# EAGLE design capa_brd (EAGLE 7.7.0)
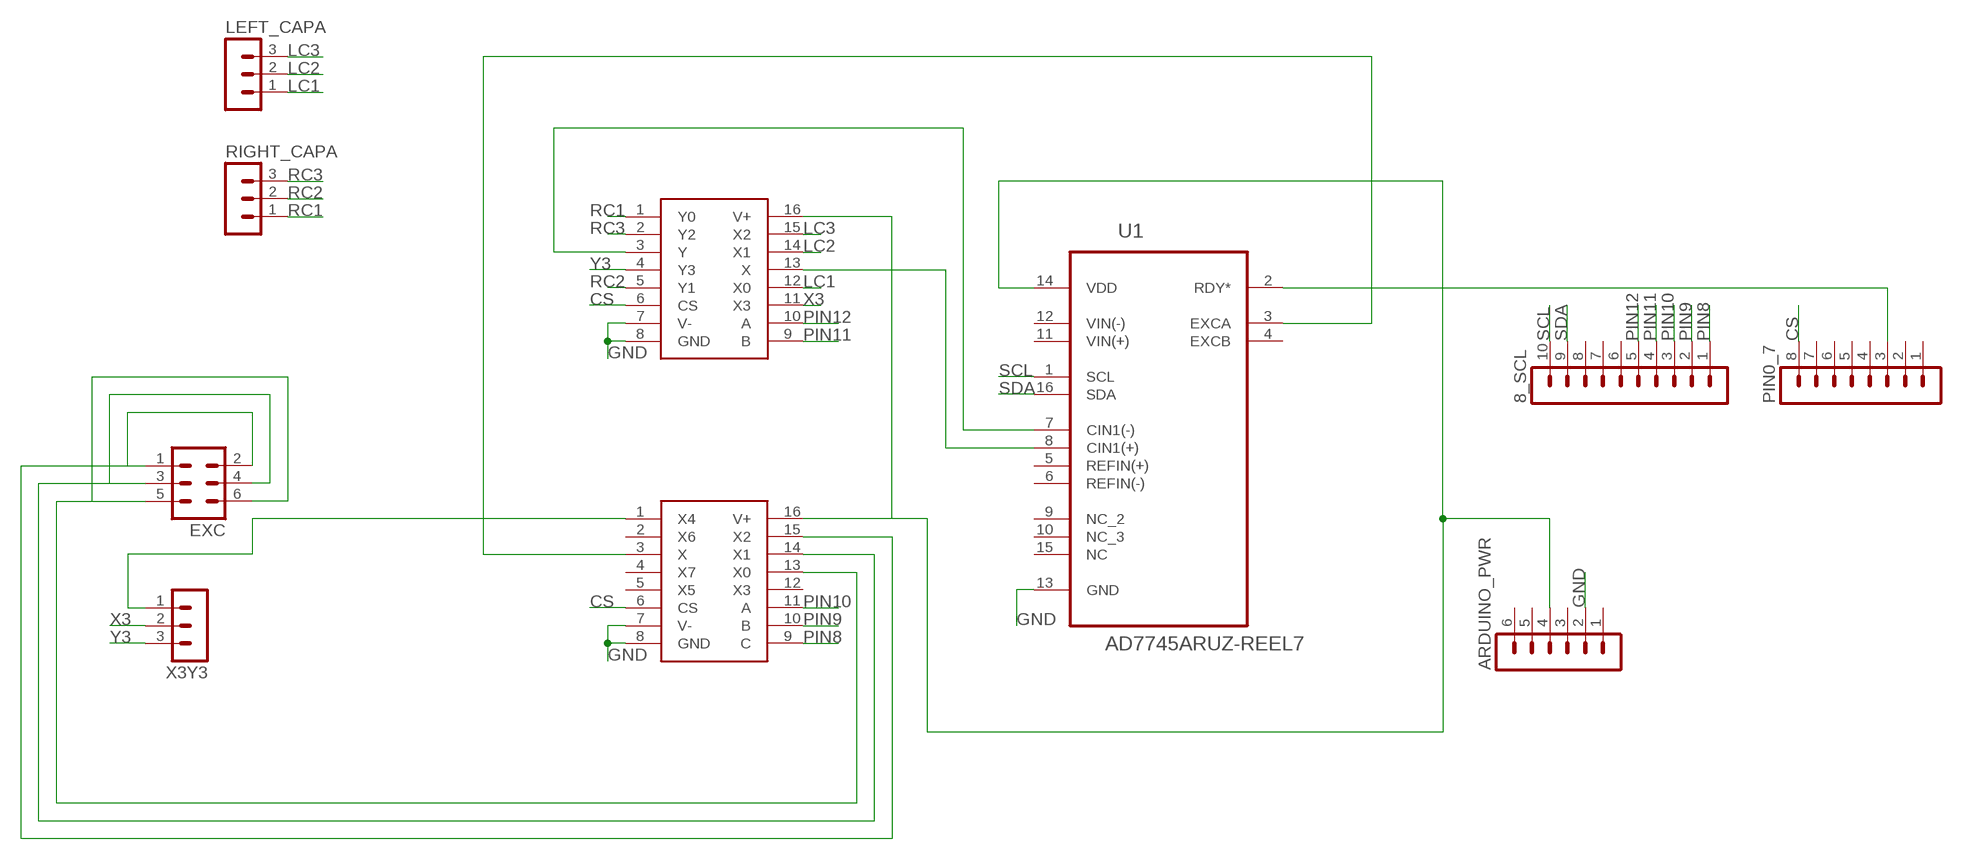
[diagram p0: schematic, sheet 1]

## Parts
8_SCL  MA10-1  [MA10-1]
ARDUINO_PWR  MA06-1  [MA06-1]
EXC  MA03-2  [MA03-2]
LEFT_CAPA  MA03-1  [MA03-1]
PIN0_7  MA08-1  [MA08-1]
RIGHT_CAPA  MA03-1  [MA03-1]
U1  AD7745ARUZ-REEL7  [SOP65P640X120-16N]
U$1  DG4051E  [DG4051E]
U$2  DG4052E  [DG4052E]
X3Y3  MA03-1  [MA03-1]

## Nets
CS: PIN0_7.8 U$1.6(CS) U$2.6(CS)
GND: ARDUINO_PWR.2 U1.13(GND) U$1.7(V-) U$1.8(GND) U$2.7(V-) U$2.8(GND)
LC1: LEFT_CAPA.1 U$2.12(X0)
LC2: LEFT_CAPA.2 U$2.14(X1)
LC3: LEFT_CAPA.3 U$2.15(X2)
N$1: U1.8(CIN1(+)) U$2.13(X)
N$2: U1.7(CIN1(-)) U$2.3(Y)
N$3: U1.3(EXCA) U$1.3(X)
N$4: EXC.5 EXC.6 U$1.13(X0)
N$5: EXC.3 EXC.4 U$1.14(X1)
N$6: EXC.1 EXC.2 U$1.15(X2)
N$7: PIN0_7.3 U1.2(RDY*)
N$8: ARDUINO_PWR.4 U1.14(VDD) U$1.16(V+) U$2.16(V+)
N$9: U$1.1(X4) X3Y3.1
PIN8: 8_SCL.1 U$1.9(C)
PIN9: 8_SCL.2 U$1.10(B)
PIN10: 8_SCL.3 U$1.11(A)
PIN11: 8_SCL.4 U$2.9(B)
PIN12: 8_SCL.5 U$2.10(A)
RC1: RIGHT_CAPA.1 U$2.1(Y0)
RC2: RIGHT_CAPA.2 U$2.5(Y1)
RC3: RIGHT_CAPA.3 U$2.2(Y2)
SCL: 8_SCL.10 U1.1(SCL)
SDA: 8_SCL.9 U1.16(SDA)
X3: U$2.11(X3) X3Y3.2
Y3: U$2.4(Y3) X3Y3.3
Unconnected: 8_SCL.6 8_SCL.7 8_SCL.8 ARDUINO_PWR.1 ARDUINO_PWR.3 ARDUINO_PWR.5 ARDUINO_PWR.6 PIN0_7.1 PIN0_7.2 PIN0_7.4 PIN0_7.5 PIN0_7.6 PIN0_7.7 U1.4(EXCB) U1.5(REFIN(+)) U1.6(REFIN(-)) U1.9(NC_2) U1.10(NC_3) U1.11(VIN(+)) U1.12(VIN(-)) U1.15(NC) U$1.2(X6) U$1.4(X7) U$1.5(X5) U$1.12(X3)

## Library data of the parts
8_SCL = con-lstb:MA10-1: PIN HEADER; OC_FARNELL: unknown; OC_NEWARK: unknown
ARDUINO_PWR = con-lstb:MA06-1: PIN HEADER; OC_FARNELL: unknown; OC_NEWARK: unknown
EXC = con-lstb:MA03-2: PIN HEADER; OC_FARNELL: unknown; OC_NEWARK: unknown
LEFT_CAPA RIGHT_CAPA X3Y3 = con-lstb:MA03-1: PIN HEADER; OC_FARNELL: unknown; OC_NEWARK: unknown
PIN0_7 = con-lstb:MA08-1: PIN HEADER; OC_FARNELL: unknown; OC_NEWARK: unknown
U1 = AD7745ARUZ-REEL7:AD7745ARUZ-REEL7: Capacitance-to-Digital Converter; DESCRIPTION: Capacitance-to-Digital Converter 24 b - Serial 16-TSSOP; DIGI-KEY_PART_NUMBER: AD7745ARUZ-REEL7TR-ND; MF: Analog Devices; MP: AD7745ARUZ-REEL7; PACKAGE: TSSOP-16 Analog Devices; PURCHASE-URL: https://pricing.snapeda.com/search/part/AD7745ARUZ-REEL7/?ref=eda
U$1 = DG4051E:DG4051E
U$2 = DG4051E:DG4052E

## Module GND
Ports: 

### Library data of the parts

## Board
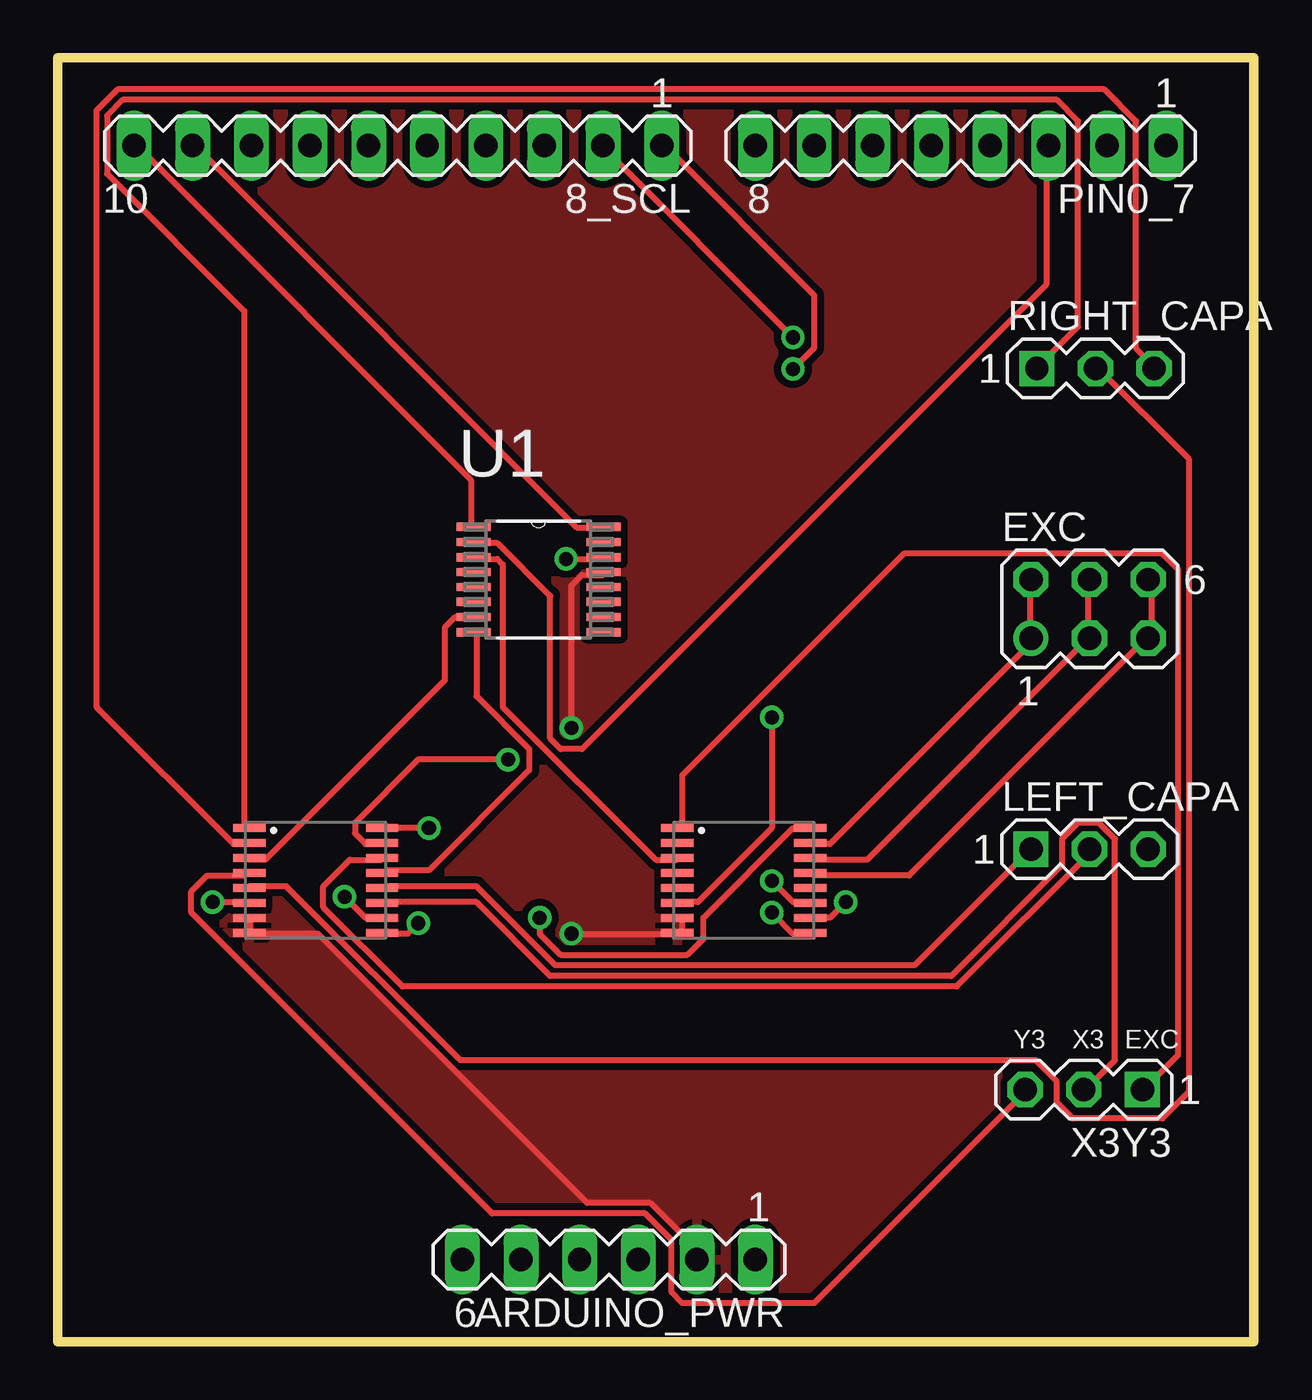
[diagram p1: board, top side]
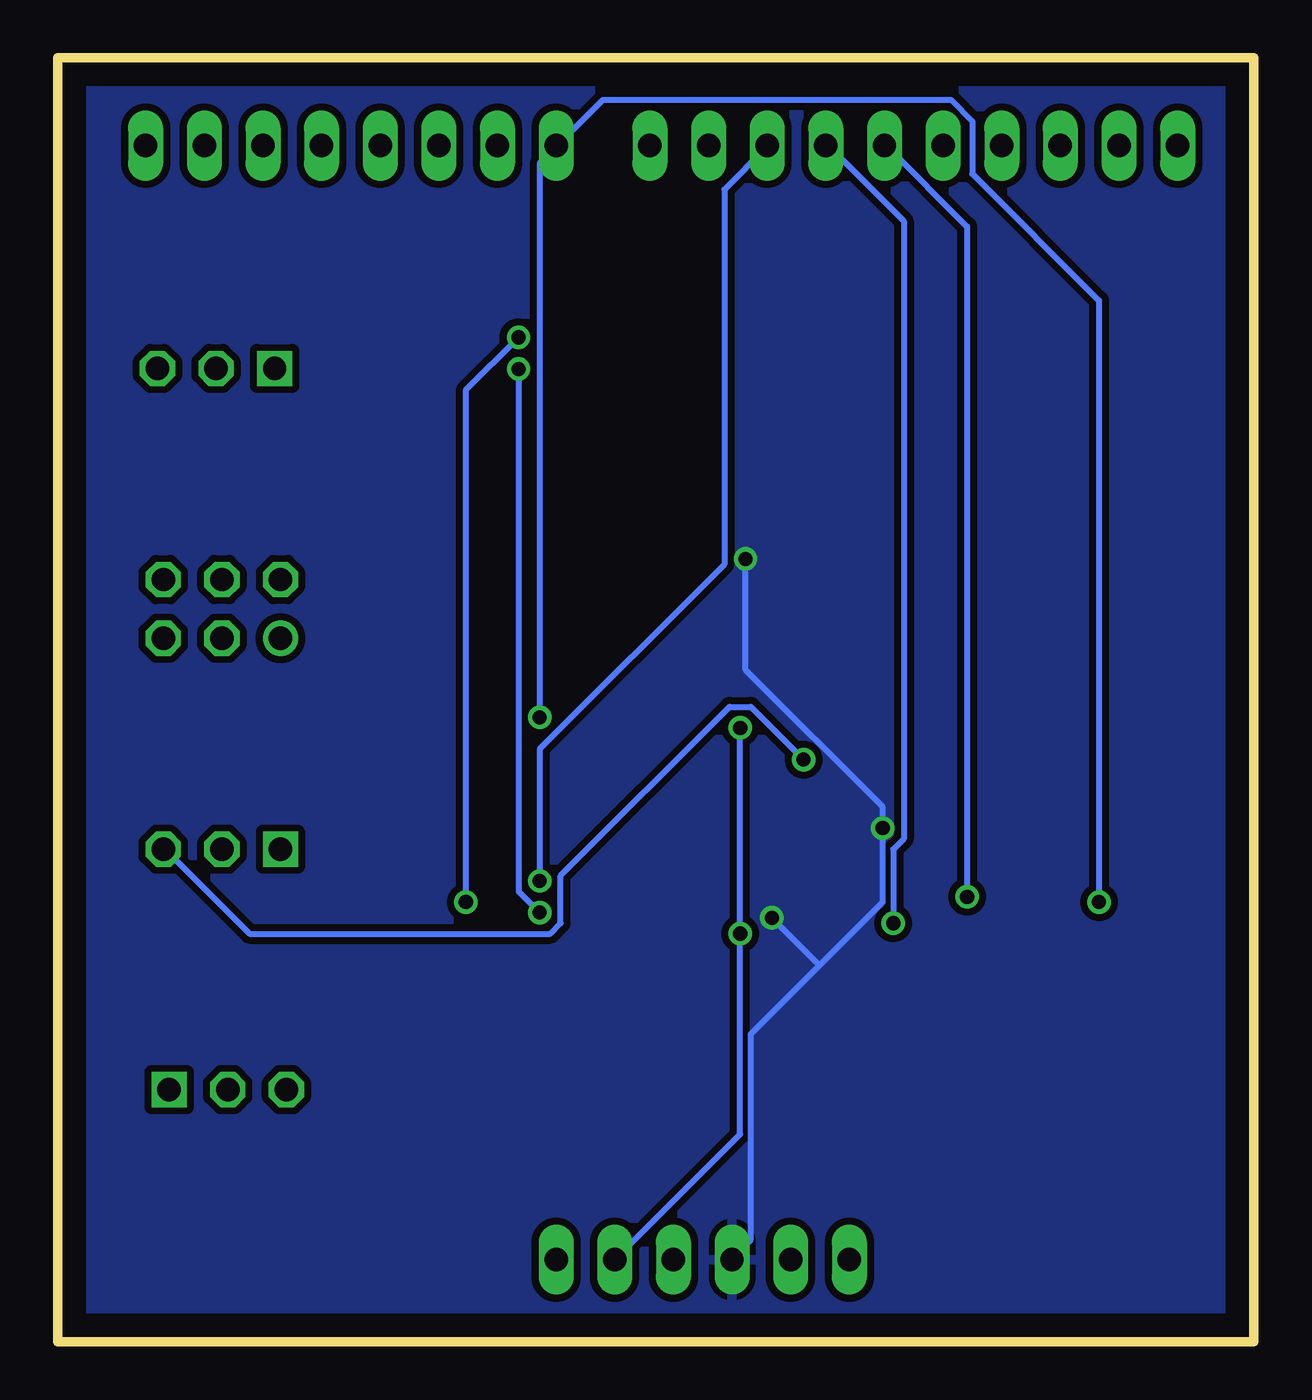
[diagram p2: board, bottom side, seen from below]

Size 51.82 x 55.63 mm. Coordinates in mm from the lower left corner, seen from the top.
Outline: 51.82,55.63 51.82,0 0,0 0,55.63 51.82,55.63
Copper layers (1*16): Top 0.035mm / dielectric 1.5mm / Bottom 0.035mm
Design rules "default": minimum track width 10mil, minimum drill 24mil, track to track 8mil, track to pad 8mil, pad to pad 8mil, via to via 8mil, smd to smd 8mil, copper to edge 40mil, drill to drill 8mil, minimum pad ring 10mil, minimum via ring 8mil, stop-mask expansion 4mil, vias tented up to drill 0mil, thermal gap 10mil

### Footprints (pad centres in the part's own frame; a part is rotated, then mirrored left to right if it is on the bottom)
MA10-1 = drill 1.016 long: 1 -11.43,0; 2 -8.89,0; 3 -6.35,0; 4 -3.81,0; 5 -1.27,0; 6 1.27,0; 7 3.81,0; 8 6.35,0; 9 8.89,0; 10 11.43,0
MA06-1 = drill 1.016 long: 1 -6.35,0; 2 -3.81,0; 3 -1.27,0; 4 1.27,0; 5 3.81,0; 6 6.35,0
MA03-2 = drill 1.016: 1 -2.54,-1.27 | drill 1.016 octagon: 2 -2.54,1.27; 3 0,-1.27; 4 0,1.27; 5 2.54,-1.27; 6 2.54,1.27
MA03-1 = drill 1.016 square: 1 -2.54,0 | drill 1.016 octagon: 2 0,0; 3 2.54,0
MA08-1 = drill 1.016 long: 1 -8.89,0; 2 -6.35,0; 3 -3.81,0; 4 -1.27,0; 5 1.27,0; 6 3.81,0; 7 6.35,0; 8 8.89,0
SOP65P640X120-16N = smd 1.473 x 0.356: 1 -2.819,2.286; 2 -2.819,1.626; 3 -2.819,0.965; 4 -2.819,0.33; 5 -2.819,-0.33; 6 -2.819,-0.965; 7 -2.819,-1.626; 8 -2.819,-2.286; 9 2.819,-2.286; 10 2.819,-1.626; 11 2.819,-0.965; 12 2.819,-0.33; 13 2.819,0.33; 14 2.819,0.965; 15 2.819,1.626; 16 2.819,2.286
DG4051E = smd 0.35 x 1.4: 1 -2.45,-2.875; 2 -1.8,-2.875; 3 -1.15,-2.875; 4 -0.5,-2.875; 5 0.15,-2.875; 6 0.8,-2.875; 7 1.45,-2.875; 8 2.1,-2.875; 9 2.1,2.875; 10 1.45,2.875; 11 0.8,2.875; 12 0.15,2.875; 13 -0.5,2.875; 14 -1.15,2.875; 15 -1.8,2.875; 16 -2.45,2.875
DG4052E = smd 0.35 x 1.4: 1 -2.45,-2.875; 2 -1.8,-2.875; 3 -1.15,-2.875; 4 -0.5,-2.875; 5 0.15,-2.875; 6 0.8,-2.875; 7 1.45,-2.875; 8 2.1,-2.875; 9 2.1,2.875; 10 1.45,2.875; 11 0.8,2.875; 12 0.15,2.875; 13 -0.5,2.875; 14 -1.15,2.875; 15 -1.8,2.875; 16 -2.45,2.875

### Placement (x,y rotation side)
8_SCL  14.73,51.82 180 top
ARDUINO_PWR  23.88,3.56 180 top
EXC  44.7,31.75 0 top
LEFT_CAPA  44.7,21.34 0 top
PIN0_7  39.12,51.82 180 top
RIGHT_CAPA  44.96,42.16 0 top
U1  20.83,33.02 0 top
U$1  29.72,19.81 270 top
U$2  11.18,19.81 270 top
X3Y3  44.45,10.92 180 top

### Tracks (layer width: path | path; a pad name or v marks a point on that pad's centre or on a via)
CS  (via drill 0.61)
  Top 0.254: v6.71,19.05 8.08,19.05 U$2.6 | v30.94,27.05 30.94,22.25 27.74,19.05 27.05,19.05 U$1.6
  Bottom 0.254: v6.71,19.05 6.71,45.11 12.19,50.6 12.19,52.88 13.11,53.8 28.19,53.8 30.02,51.97 PIN0_7.8 30.25,51.74 30.94,51.05 v30.94,27.05
GND  (via drill 0.61)
  Top 0.254: U$1.7 27.05,18.36 27.05,17.68 U$1.8 26.82,17.68 v22.25,17.68 | 8.31,17.68 U$2.7 | v22.25,26.59 22.25,32.77 22.71,33.22 23.62,33.22 U1.13 | 8.31,17.68 11.28,17.68 22.94,6.02 25.68,6.02 27.51,4.19 27.51,3.73 ARDUINO_PWR.2 | 8.31,17.68 U$2.8
  Bottom 0.254: v22.25,26.59 v22.25,17.68 22.25,8.99 ARDUINO_PWR.2
  pour Top (isolate 0.305): 0.25,55.37 0.25,0.25 51.56,0.25 51.56,55.37 50.8,55.37
LC1
  Top 0.254: U$2.12 14.25,19.74 18.14,19.74 21.56,16.31 37.11,16.31 42.14,21.34 LEFT_CAPA.1
LC2
  Top 0.254: U$2.14 14.02,20.88 12.65,20.88 11.51,19.74 11.51,18.82 14.94,15.39 38.94,15.39 44.88,21.34 LEFT_CAPA.2
LC3  (via drill 0.61)
  Top 0.254: v19.51,25.22 15.62,25.22 12.88,22.48 12.88,22.02 13.33,21.56 14.02,21.56 U$2.15
  Bottom 0.254: v19.51,25.22 21.79,27.51 22.71,27.51 30.02,20.19 30.02,18.14 30.48,17.68 43.51,17.68 47.17,21.34 LEFT_CAPA.3
N$1
  Top 0.254: U$2.13 14.25,20.42 16.08,20.42 20.42,24.77 20.42,25.68 18.14,27.96 18.14,30.71 U1.8
N$2
  Top 0.254: U1.7 17.22,31.39 16.76,30.94 16.76,28.65 8.99,20.88 8.31,20.88 U$2.3
N$3
  Top 0.254: U$1.3 26.82,20.88 25.91,20.88 19.28,27.51 19.28,33.68 19.05,33.91 18.14,33.91 U1.3
N$4
  Top 0.254: U$1.13 32.77,20.19 36.88,20.19 47.17,30.48 EXC.5 47.4,30.48 47.4,32.99 EXC.6
N$5
  Top 0.254: 44.65,30.48 35.05,20.88 32.77,20.88 U$1.14 | 44.65,30.48 44.65,32.99 EXC.4 | 44.65,30.48 EXC.3
N$6
  Top 0.254: U$1.15 32.77,21.56 33.45,21.56 42.37,30.48 EXC.1 42.14,30.48 42.14,32.99 EXC.2
N$7
  Top 0.254: U1.2 18.14,34.59 19.05,34.59 21.34,32.31 21.34,26.14 21.79,25.68 22.71,25.68 42.82,45.8 42.82,51.74 PIN0_7.3
N$8  (via drill 0.61)
  Top 0.254: v16.08,22.25 14.25,22.25 U$2.16 | v20.88,18.36 20.88,17.68 21.79,16.76 27.28,16.76 27.96,17.45 27.96,18.36 31.85,22.25 32.54,22.25 U$1.16 | v22.02,33.91 23.62,33.91 U1.14
  Bottom 0.254: 18.82,16.31 21.79,13.34 21.79,4.42 22.48,3.73 ARDUINO_PWR.4 | 18.82,16.31 16.08,19.05 v16.08,22.25 16.08,23.16 22.02,29.11 v22.02,33.91 | 18.82,16.31 v20.88,18.36
  pour Bottom (isolate 0.305): 0.25,55.37 0.25,0.25 51.56,0.25 51.56,55.37
N$9
  Top 0.254: U$1.1 27.05,22.25 27.05,24.54 36.65,34.14 47.85,34.14 48.54,33.45 48.54,12.42 47.17,11.05 X3Y3.1
PIN8  (via drill 0.61)
  Top 0.254: v30.94,18.59 31.85,17.68 32.54,17.68 U$1.9 | v31.85,42.14 32.77,43.05 32.77,45.34 26.36,51.74 8_SCL.1
  Bottom 0.254: v30.94,18.59 31.85,19.51 v31.85,42.14
PIN9  (via drill 0.61)
  Top 0.254: v34.14,19.05 33.45,18.36 32.77,18.36 U$1.10 | v31.85,43.51 23.62,51.74 8_SCL.2
  Bottom 0.254: v34.14,19.05 34.14,41.22 v31.85,43.51
PIN10  (via drill 0.61)
  Top 0.254: v30.94,19.96 31.85,19.05 32.54,19.05 U$1.11
  Bottom 0.254: v30.94,19.96 30.94,25.68 22.94,33.68 22.94,49.91 21.11,51.74 8_SCL.3
PIN11  (via drill 0.61)
  Top 0.254: v15.62,18.14 15.16,17.68 14.25,17.68 U$2.9
  Bottom 0.254: v15.62,18.14 15.62,21.34 15.16,21.79 15.16,48.54 18.36,51.74 8_SCL.4
PIN12  (via drill 0.61)
  Top 0.254: v12.42,19.28 13.33,18.36 14.02,18.36 U$2.10
  Bottom 0.254: v12.42,19.28 12.42,48.31 15.85,51.74 8_SCL.5
RC1
  Top 0.254: U$2.1 8.08,22.25 8.08,44.65 2.13,50.6 2.13,53.11 2.82,53.8 43.28,53.8 44.2,52.88 44.2,43.97 42.6,42.37 RIGHT_CAPA.1
RC2
  Top 0.254: U$2.5 8.31,19.74 9.91,19.74 17.45,12.19 42.37,12.19 43.28,11.28 43.28,10.36 43.97,9.68 47.85,9.68 49,10.82 49,38.25 45.11,42.14 RIGHT_CAPA.2
RC3
  Top 0.254: U$2.2 8.08,21.56 7.62,21.56 1.68,27.51 1.68,53.34 2.59,54.25 45.34,54.25 46.71,52.88 46.71,43.05 47.4,42.37 RIGHT_CAPA.3
SCL
  Top 0.254: U1.1 17.91,35.28 17.91,37.34 3.51,51.74 8_SCL.10
SDA
  Top 0.254: U1.16 23.62,35.28 22.48,35.28 6.02,51.74 8_SCL.9
X3
  Top 0.254: U$2.11 14.25,19.05 18.14,19.05 21.34,15.85 38.71,15.85 43.51,20.65 43.51,21.79 44.2,22.48 45.11,22.48 45.8,21.79 45.8,12.19 44.65,11.05 X3Y3.2
Y3
  Top 0.254: U$2.4 8.08,20.19 6.48,20.19 5.79,19.51 5.79,18.59 18.82,5.56 25.45,5.56 26.59,4.42 26.59,2.13 27.05,1.68 32.77,1.68 41.91,10.82 X3Y3.3

### Text on the board
tNames: Y3 | X3 | EXC